# Altium project LED.PrjPcb
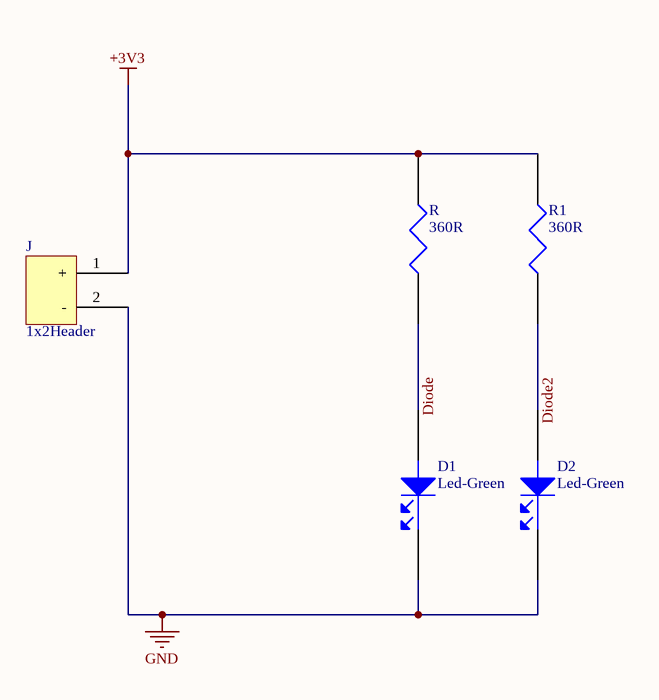
[diagram p0: Schematic.SchDoc]
1 sheet, 5 parts. Net scope: global (net labels, ports and power ports of the same name join across sheets).
Board file: PCB.PcbDoc

## Sheet Schematic.SchDoc
size A4; SheetNumber: 1; SheetTotal: 1

### Parts
D1  Led-Green  [LED0603G]
D2  Led-Green  [LED0603G]
J  1x2Header  [HDR1X2]
R  360R  [R805]
R1  360R  [R805]

### Nets
+3V3: J.1(+) R.2 R1.2
GND: D1.2 D2.2 J.2(-)
Diode: D1.1 R.1
Diode2: D2.1 R1.1

### Library data of the parts
D1 D2 = 150060GS75000: Single Color LED, Green, Water Clear, 1.1mm; Manufacturer: Wurth Electronics; Shape: Rectangular; Forward Current: 30mA; Luminous Intensity-Nom: 430mcd; Channels: 1; Viewing Angle: 140°; Overall Height: 0.7mm; Supplier: Digikey; Supplier Part Number: 732-4971-1-ND; Manufacturer Part Number: 150060GS75000; RoHS: Yes; Category: LEDs; Stock: 77230; Pricing: 1=0.15, 50=0.142, 100=0.122, 500=0.105 (USD); Mounting Technology: Surface Mount; Pins: 2; Color: Green; Min Operating Temperature: -40°C; Max Operating Temperature: 85°C; Lens Style: WATER CLEAR; Optoelectronic Device Type: SINGLE COLOR LED; Packaging: Tape and Reel; Size: 1.1mm; Terminal Pitch: 1.6mm; Reach SVHC Compliant: Yes; RoHS Compliant: Yes; ComponentLink1URL: https://datasheet.ciiva.com:443/pdfs/VipMasterIC/IC/MIDC/MIDC-S-A0007790169/MIDC-S-A0007790169-1.pdf?src-supplier=IHS+Markit; ComponentLink1Description: https://datasheet.ciiva.com:443/pdfs/VipMasterIC/IC/MIDC/MIDC-S-A0007790169/MIDC-S-A0007790169-1.pdf?src-supplier=IHS+Markit; ComponentLink2URL: https://datasheet.ciiva.com/29562/150060gs75000-29562868.pdf?src-supplier=Digikey; ComponentLink2Description: https://datasheet.ciiva.com/29562/150060gs75000-29562868.pdf?src-supplier=Digikey; ComponentLink3URL: https://datasheet.ciiva.com/29279/759427-da-01-en-chipled-0603-w-kl-gruen-150060gs75000-29279201.pdf?src-supplier=Conrad; ComponentLink3Description: https://datasheet.ciiva.com/29279/759427-da-01-en-chipled-0603-w-kl-gruen-150060gs75000-29279201.pdf?src-supplier=Conrad; ComponentLink4URL: https://datasheet.ciiva.com/29562/150060gs75000-29562869.pdf?src-supplier=Digikey; ComponentLink4Description: https://datasheet.ciiva.com/29562/150060gs75000-29562869.pdf?src-supplier=Digikey; ComponentLink5URL: https://datasheet.ciiva.com/29562/150060gs75000-29562870.pdf?src-supplier=Digikey; ComponentLink5Description: https://datasheet.ciiva.com/29562/150060gs75000-29562870.pdf?src-supplier=Digikey
J = 22-29-2021: Board Connector, 2 Contact(s), 1 Row(s), Male, Straight, 0.1 inch Pitch, Solder Terminal, Locking, White Insulator, Receptacle; Manufacturer: Molex; Option: General Purpose; Contact Pattern: RECTANGULAR; Contact Resistance: 10mR; Contact Style: SQ PIN-SKT; Durability: 25Cycles; Filter Feature: No; Insulation Resistance: 1GR; Mating Information: MULTIPLE MATING PARTS AVAILABLE; Number Of Connectors: 1; Polarization Key: POLARIZED HOUSING; Rated Current (Signal): 4A; Number of Contacts: 2; Body Breadth: 0.23inch; Body Depth: 0.46inch; Body Length: 0.2inch; Plating Thickness: 20uin; Reference Standard: UL; Reliability: COMMERCIAL; Supplier: Digikey; Supplier Part Number: WM2744-ND; Manufacturer Part Number: 22-29-2021; RoHS: Yes; Pricing: 1=0.34, 10=0.286, 100=0.2225, 3000=0.18654 (USD); Mounting Technology: Board; Contact Finish - Mating: GOLD; Contact Finish - Termination: Gold (Au); Insulation Color: White; Insulation Material: Nylon; Min Operating Temperature: 0°C; Max Operating Temperature: 75°C; Connector Type: BOARD CONNECTOR; JESD-609 Code: e4; Body/Shell Style: RECEPTACLE; Contact Gender: Male; Mixed Contacts: No; Mounting Style: STRAIGHT; Number Of PCB Rows: 1; Number of Rows Loaded: 1; PCB Contact Pattern: RECTANGULAR; Termination: Solder; Mating Contact Pitch: 0.1inch; Mounting Option 1: LOCKING; Terminal Length: 0.14inch; Terminal Pitch: 2.54mm; Flammability Rating: UL94 V-0; Reach SVHC Compliant: Yes; RoHS Compliant: Yes; DIN Conformance: No; IEC Conformance: No; MIL Conformance: No; ComponentLink1URL: https://datasheet.ciiva.com:443/pdfs/VipMasterIC/IC/MOLE/MOLE-E-A0003552261/MOLE-S-A0003534498-1.pdf?src-supplier=IHS+Markit; ComponentLink1Description: https://datasheet.ciiva.com:443/pdfs/VipMasterIC/IC/MOLE/MOLE-E-A0003552261/MOLE-S-A0003534498-1.pdf?src-supplier=IHS+Markit; Parameter 1: *; Category: Connectors
R R1 = RC0805JR-07360RL: Fixed Resistor, Metal Glaze/thick Film, 0.125W, 360ohm, 150V, 5% +/-Tol, 100ppm/Cel, Surface Mount, 0805; Manufacturer: Yageo; Additional Feature: LASER TRIMMABLE; Power: 125mW; Rated Temperature: 70°C; Temperature Coefficient: 100ppm/°C; Package Height: 0.5mm; Package Length: 2mm; Package Width: 1.25mm; Supplier: Digikey; Supplier Part Number: 311-360ARCT-ND; Manufacturer Part Number: RC0805JR-07360RL; RoHS: Yes; Category: Chip SMD Resistors; Stock: 128634; Pricing: 1=0.1, 10=0.023, 50=0.0144, 100=0.012, 500=0.00818, 1000=0.00706 (USD); Mounting Technology: Surface Mount; Pins: 2; Package Shape: Rectangular; Case/Package: 0805; Terminal Finish: Nickel; Min Operating Temperature: -55°C; Max Operating Temperature: 155°C; Tolerance: 5%; JESD-609 Code: e3; Resistor Type: FIXED RESISTOR; Construction: Chip; Package Style: SMTMeter; Packaging: Tape and Reel; Value: 360R; Technology: METAL GLAZE/THICK FILM; Termination: Wraparound; Working Voltage: 150V; Reach SVHC Compliant: Yes; RoHS Compliant: Yes; ComponentLink1URL: https://datasheet.ciiva.com:443/pdfs/VipMasterIC/IC/YAGO/YAGO-S-A0008145938/YAGO-S-A0008145938-1.pdf?src-supplier=IHS+Markit; ComponentLink1Description: https://datasheet.ciiva.com:443/pdfs/VipMasterIC/IC/YAGO/YAGO-S-A0008145938/YAGO-S-A0008145938-1.pdf?src-supplier=IHS+Markit; ComponentLink2URL: https://datasheet.ciiva.com/2508/pyu-r-int-thick-7-2508741.pdf?src-supplier=Digikey; ComponentLink2Description: https://datasheet.ciiva.com/2508/pyu-r-int-thick-7-2508741.pdf?src-supplier=Digikey; ComponentLink3URL: https://datasheet.ciiva.com/2508/pyu-r-int-thick-7-2508742.pdf?src-supplier=Digikey; ComponentLink3Description: https://datasheet.ciiva.com/2508/pyu-r-int-thick-7-2508742.pdf?src-supplier=Digikey; ComponentLink4URL: https://datasheet.ciiva.com/2508/pyu-r-int-thick-7-2508743.pdf?src-supplier=Digikey; ComponentLink4Description: https://datasheet.ciiva.com/2508/pyu-r-int-thick-7-2508743.pdf?src-supplier=Digikey; ComponentLink5URL: https://datasheet.ciiva.com/16745/rc0805-16745688.pdf?src-supplier=Future+Electronics; ComponentLink5Description: https://datasheet.ciiva.com/16745/rc0805-16745688.pdf?src-supplier=Future+Electronics

## Assembly variants
LED2 not fitted: not fitted D2 R1